# EasyEDA schematic SCH_TEMPEC-CLOUD-SMD_2022-08-11.json

## Sheets
1 CONTROL: TITLE: CONTROL; REV: 1.0; Date: 2022-07-27; Sheet: 1/1; Drawn By: GERMAN VILLARES; Company: DIINPEC
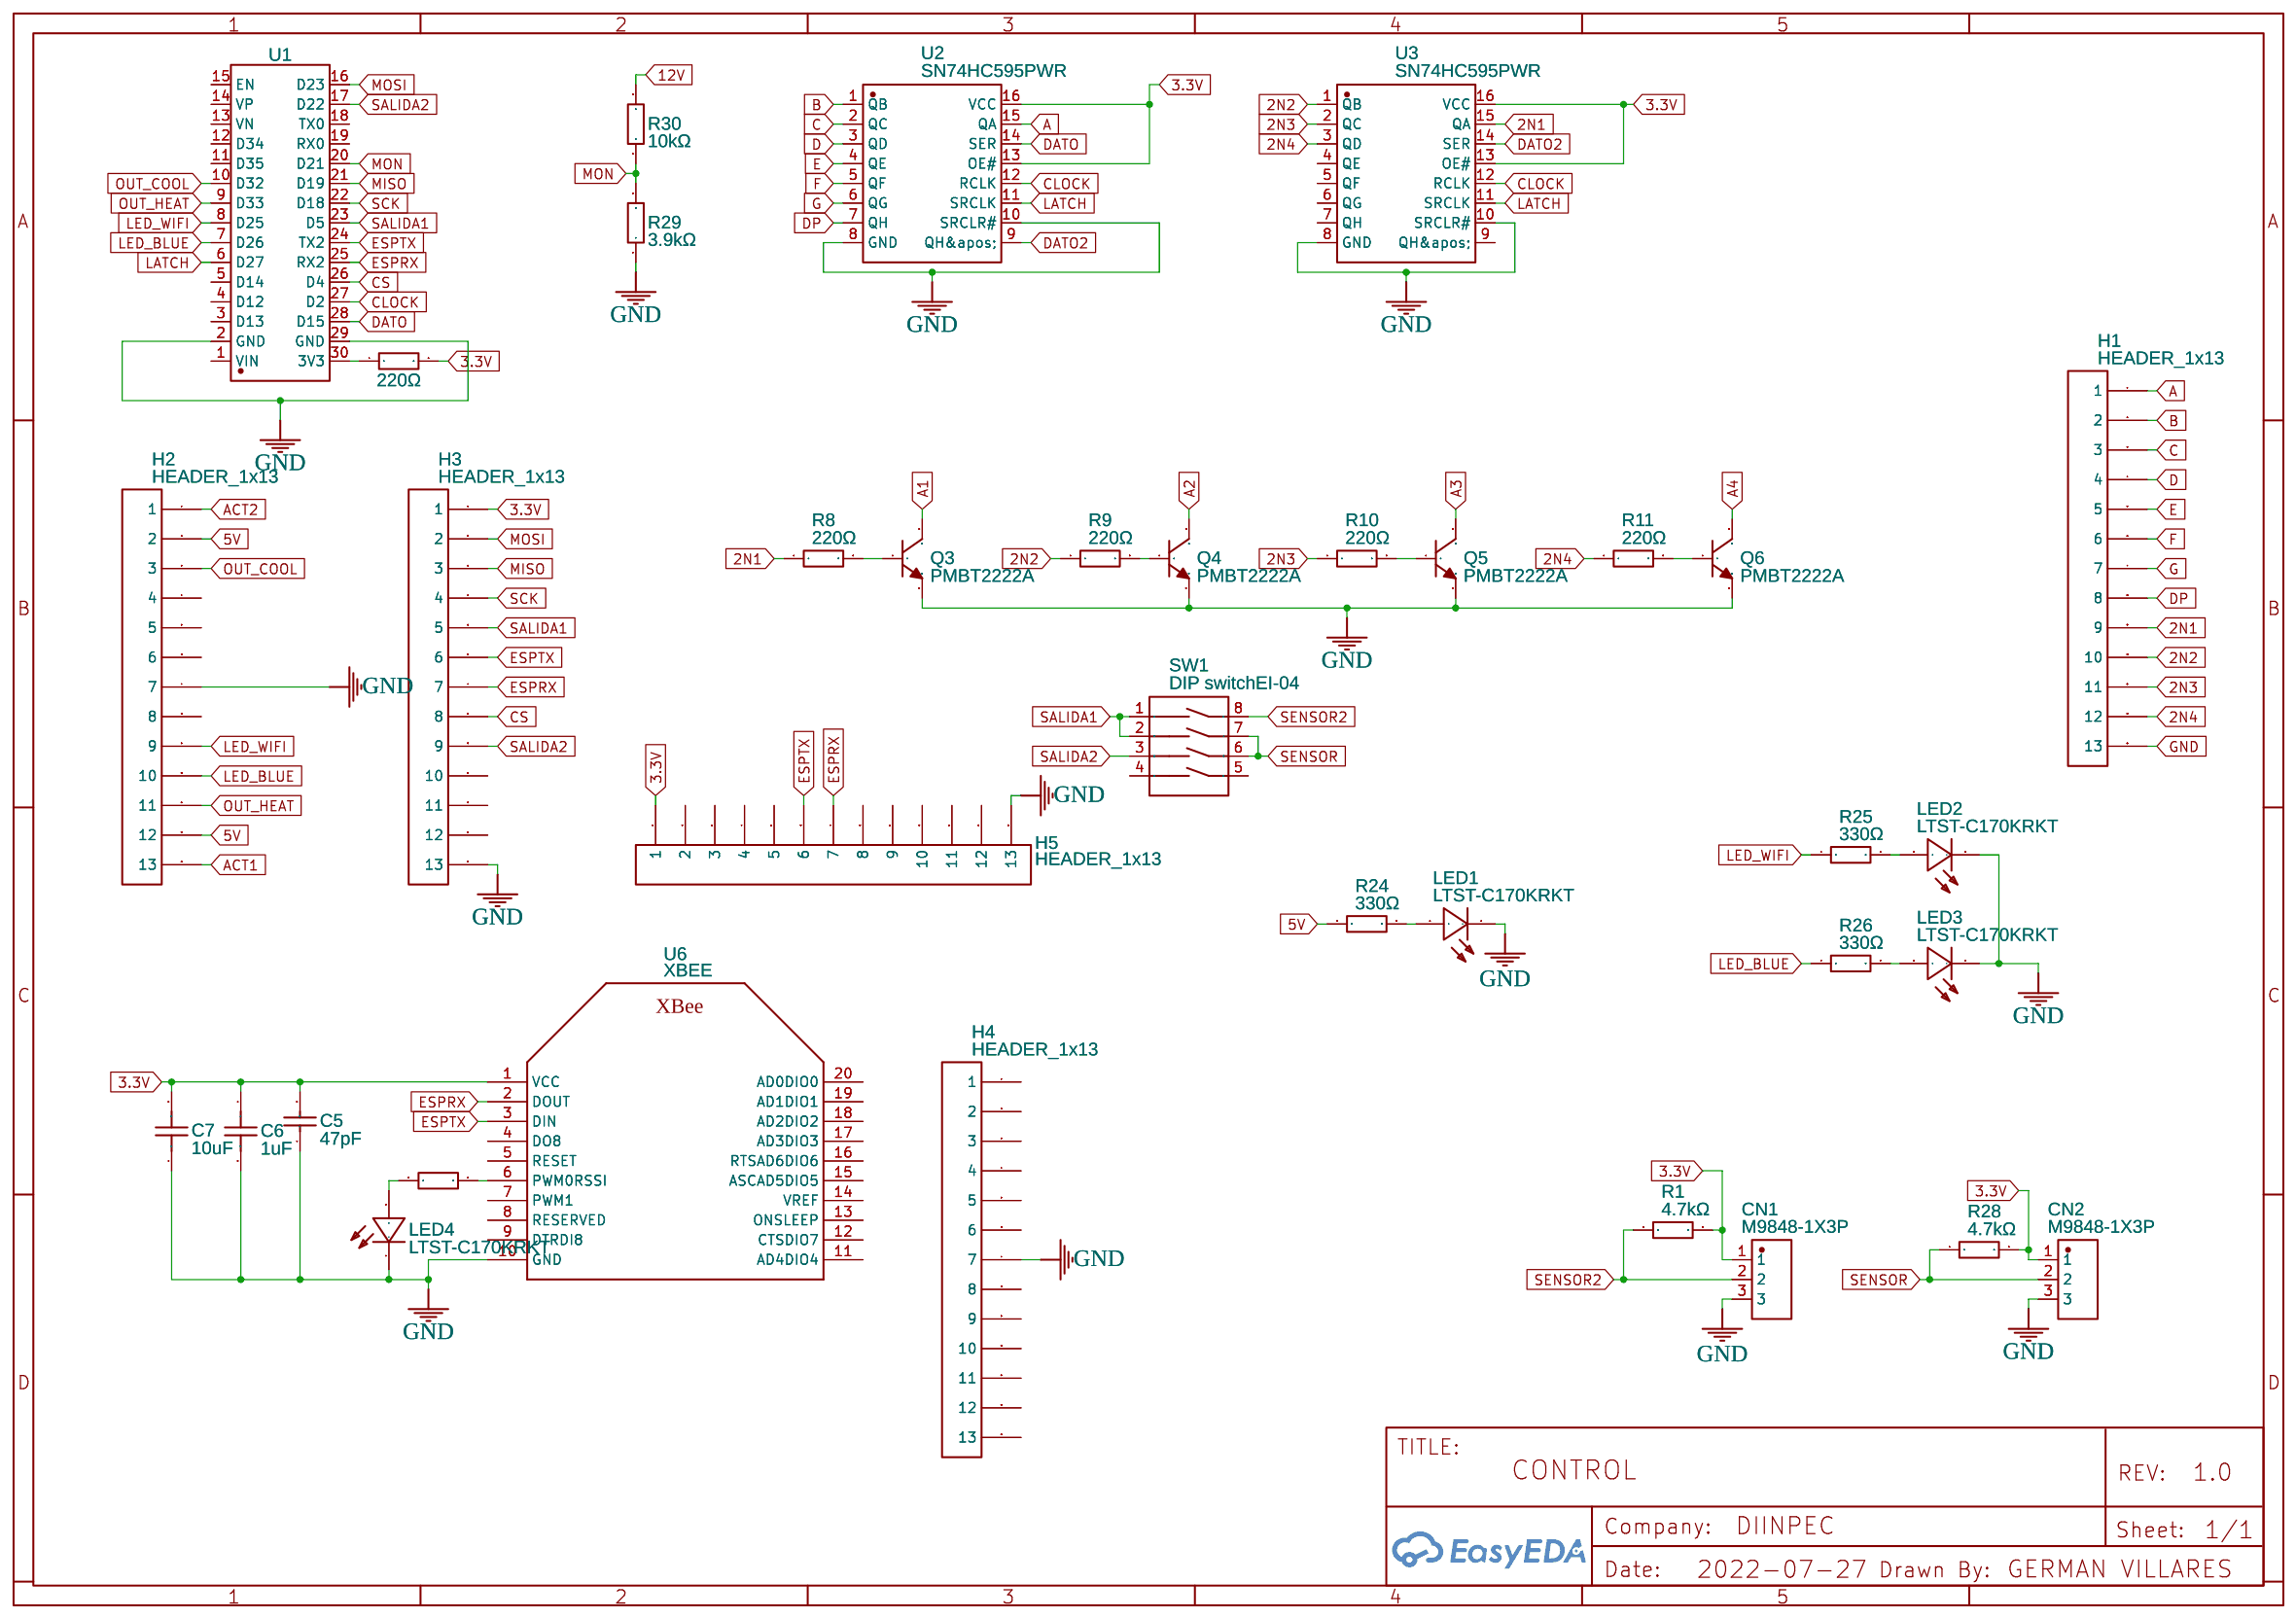
[diagram p0: CONTROL]
2 POTENCIA: TITLE: POTENCIA; Date: 2022-07-28
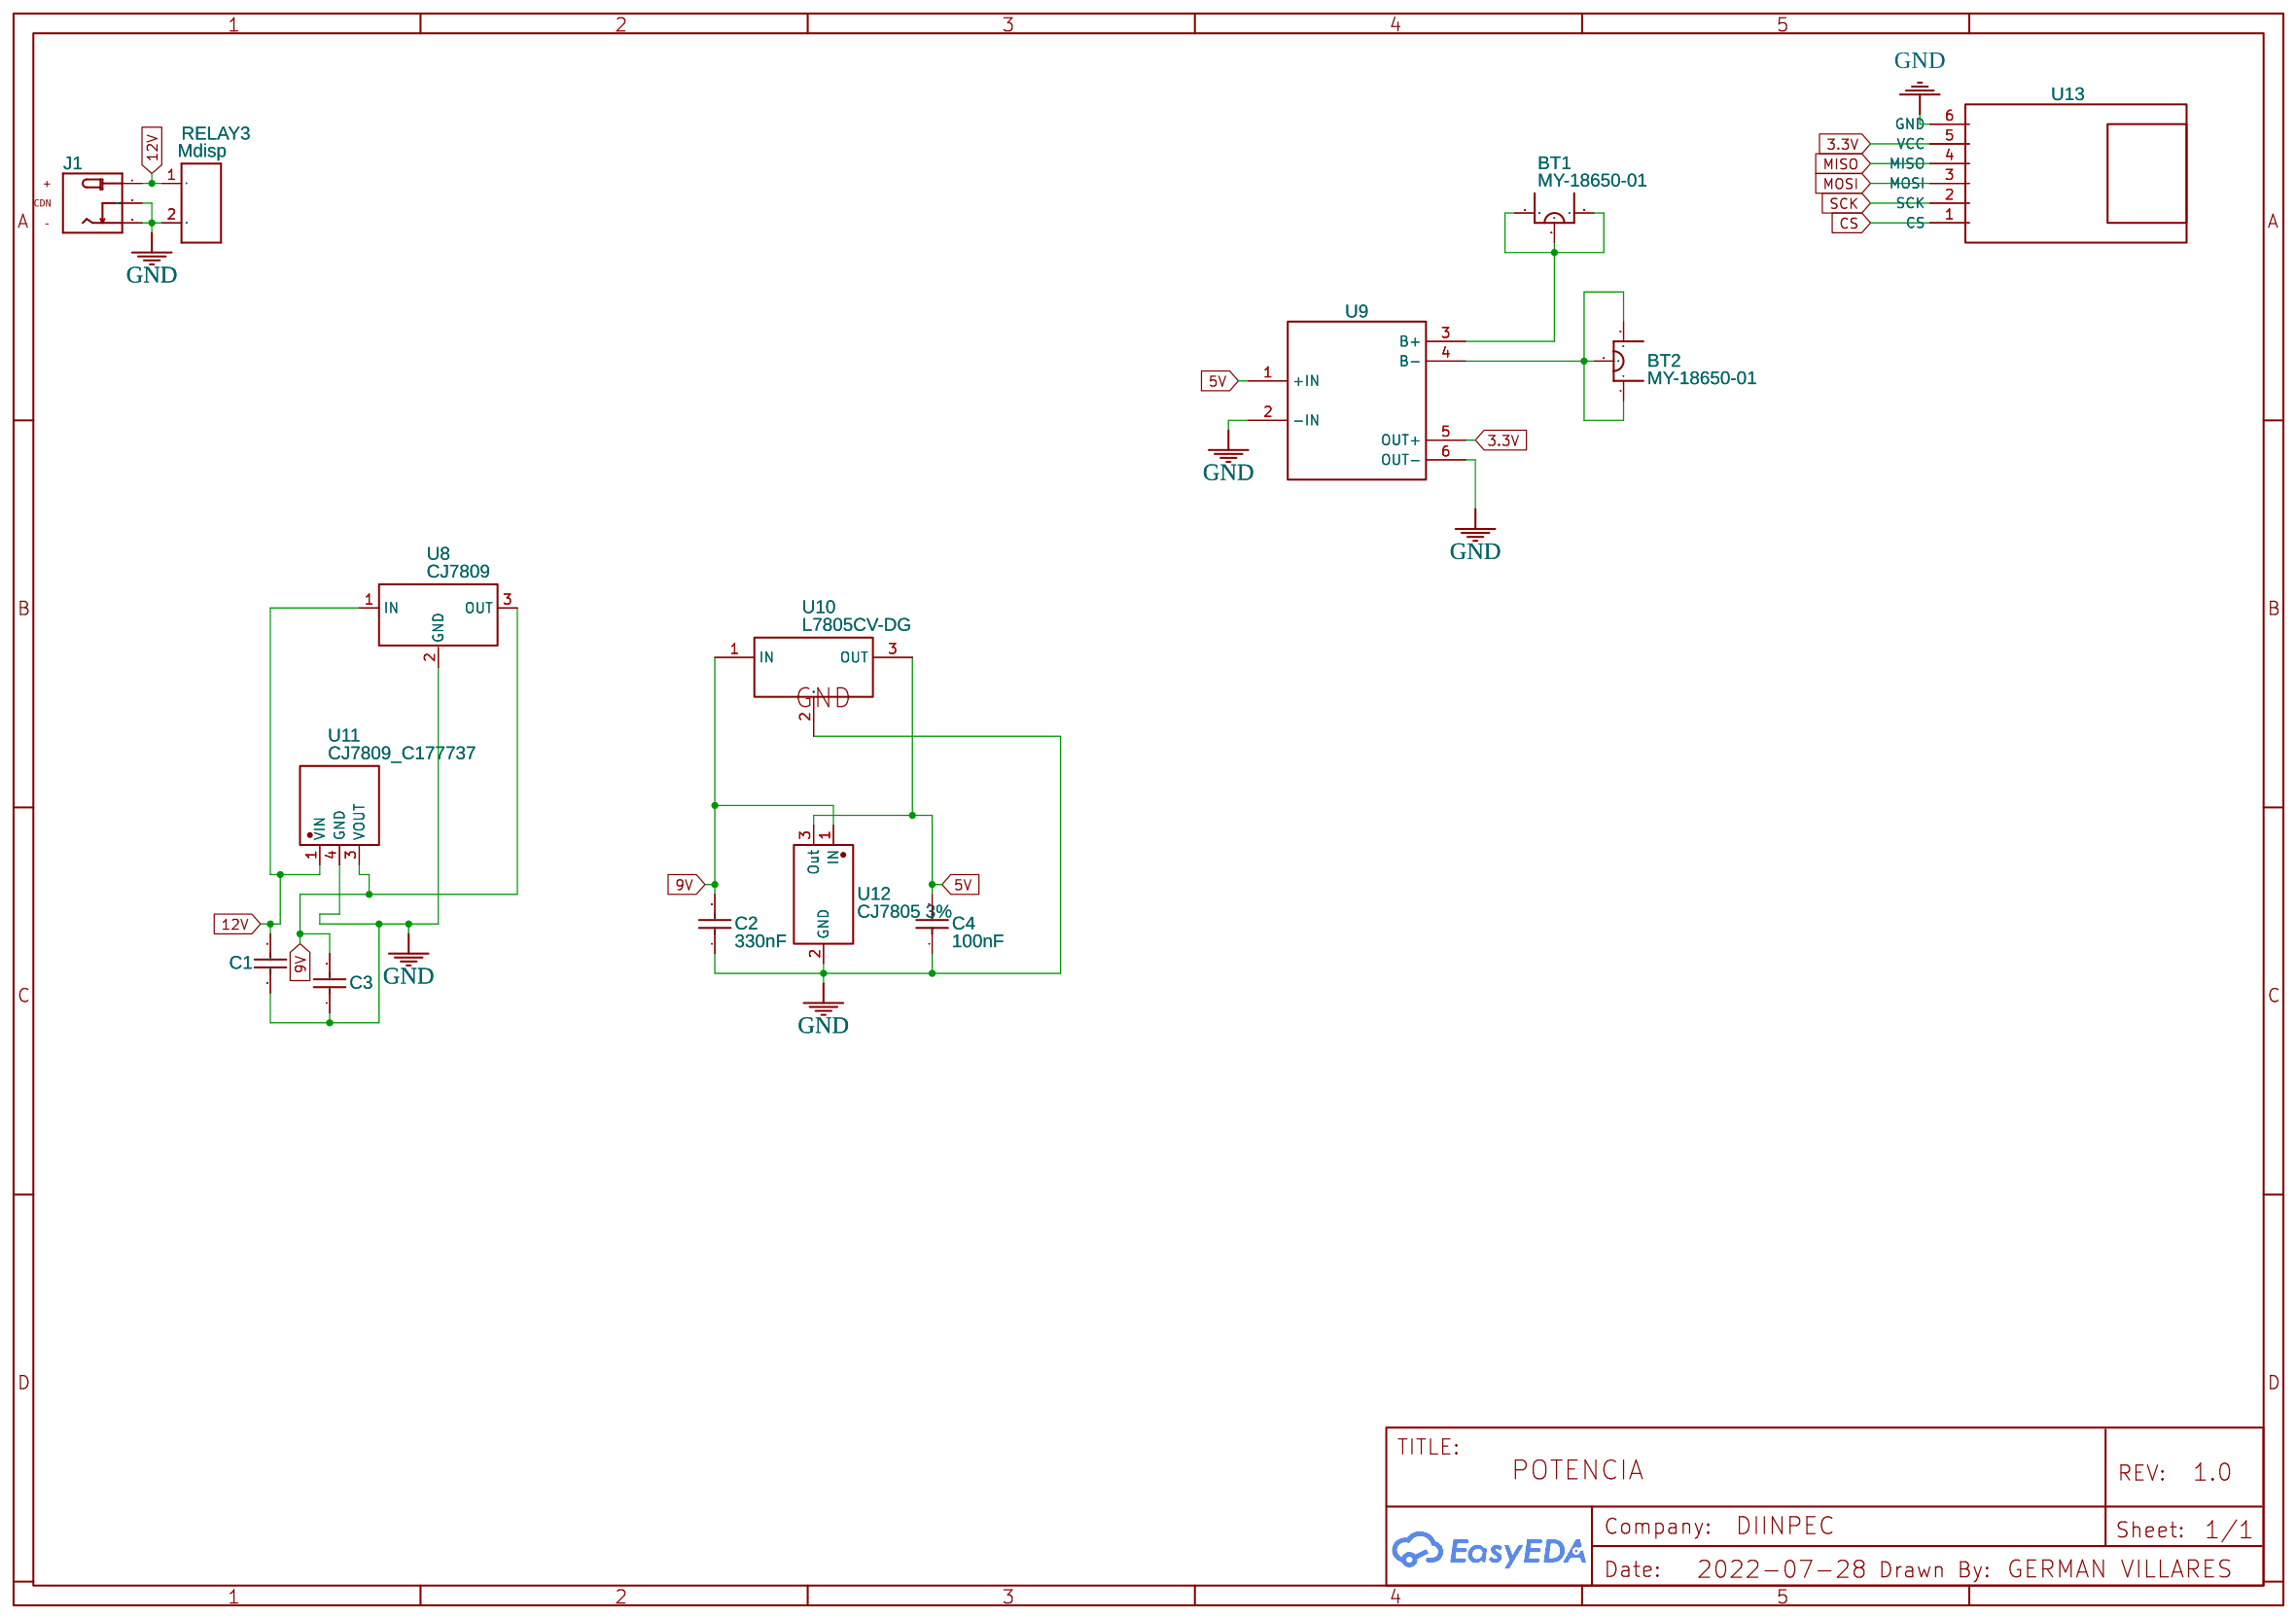
[diagram p1: POTENCIA]
3 Relevadores: TITLE: RELEVADORES; Date: 2022-08-01; Drawn By: German Villares; Company: Diinpec
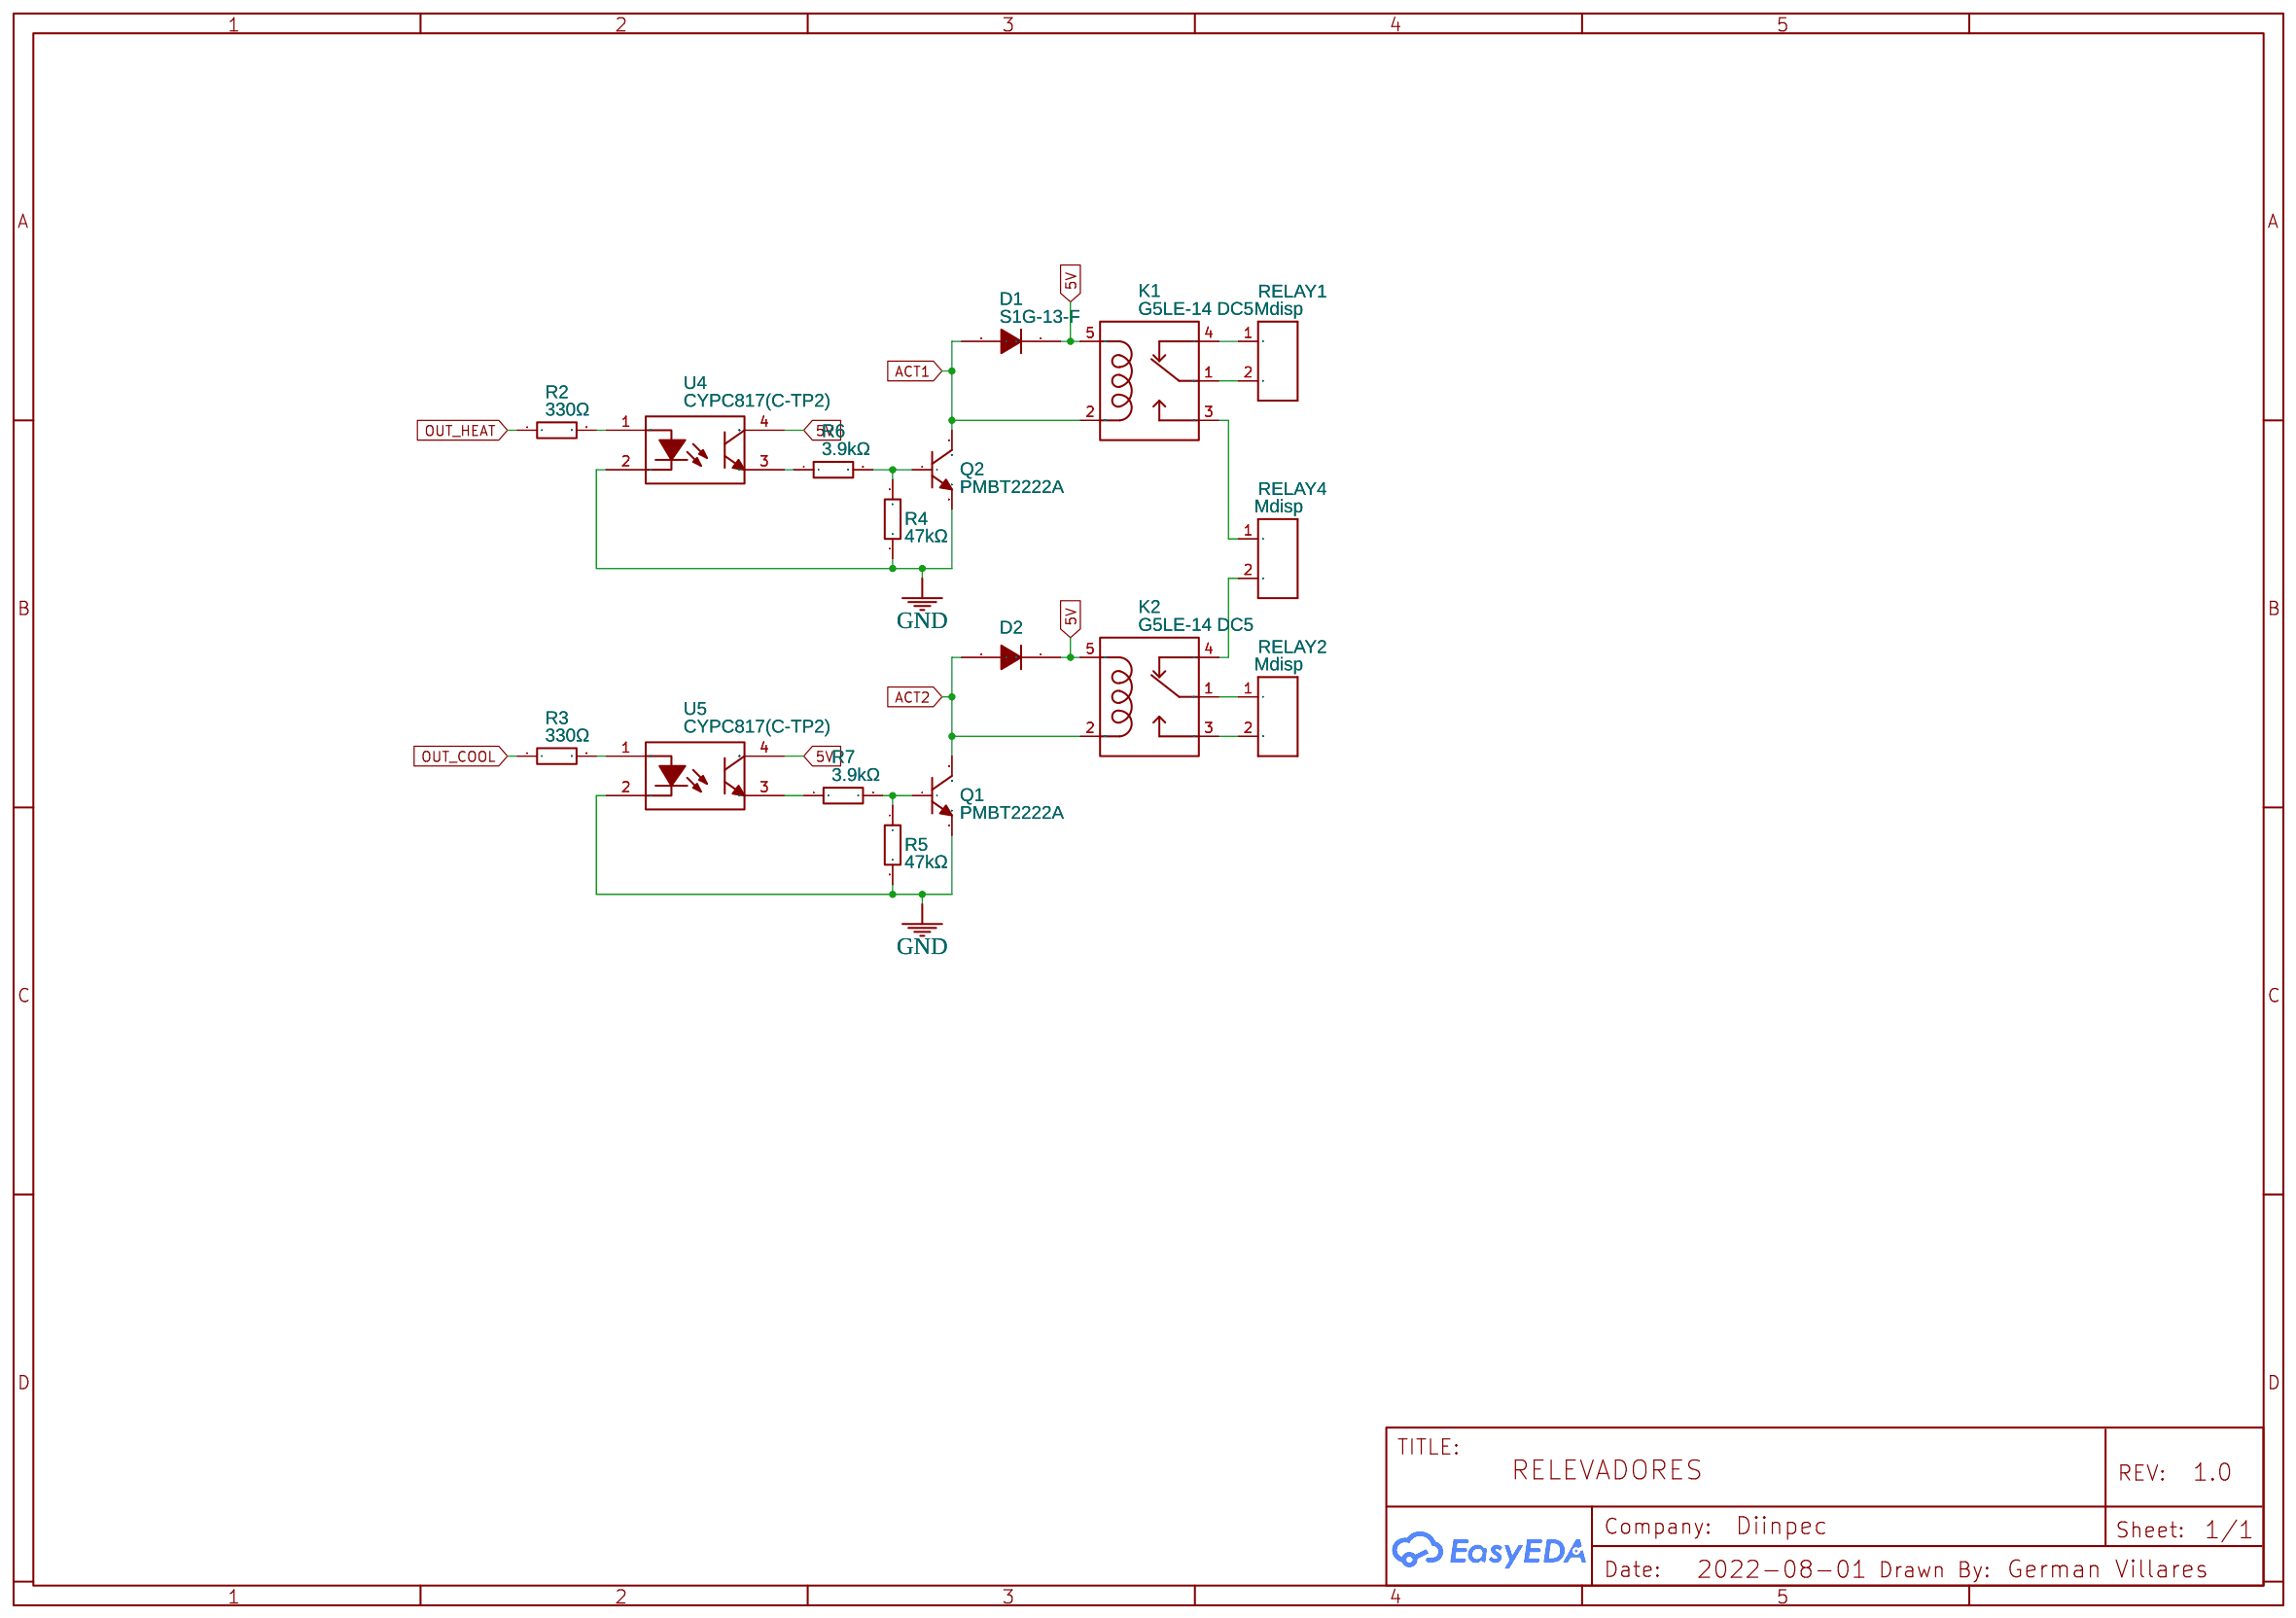
[diagram p2: Relevadores]
4 DISPLAY: TITLE: DISPLAY; Date: 2022-08-01
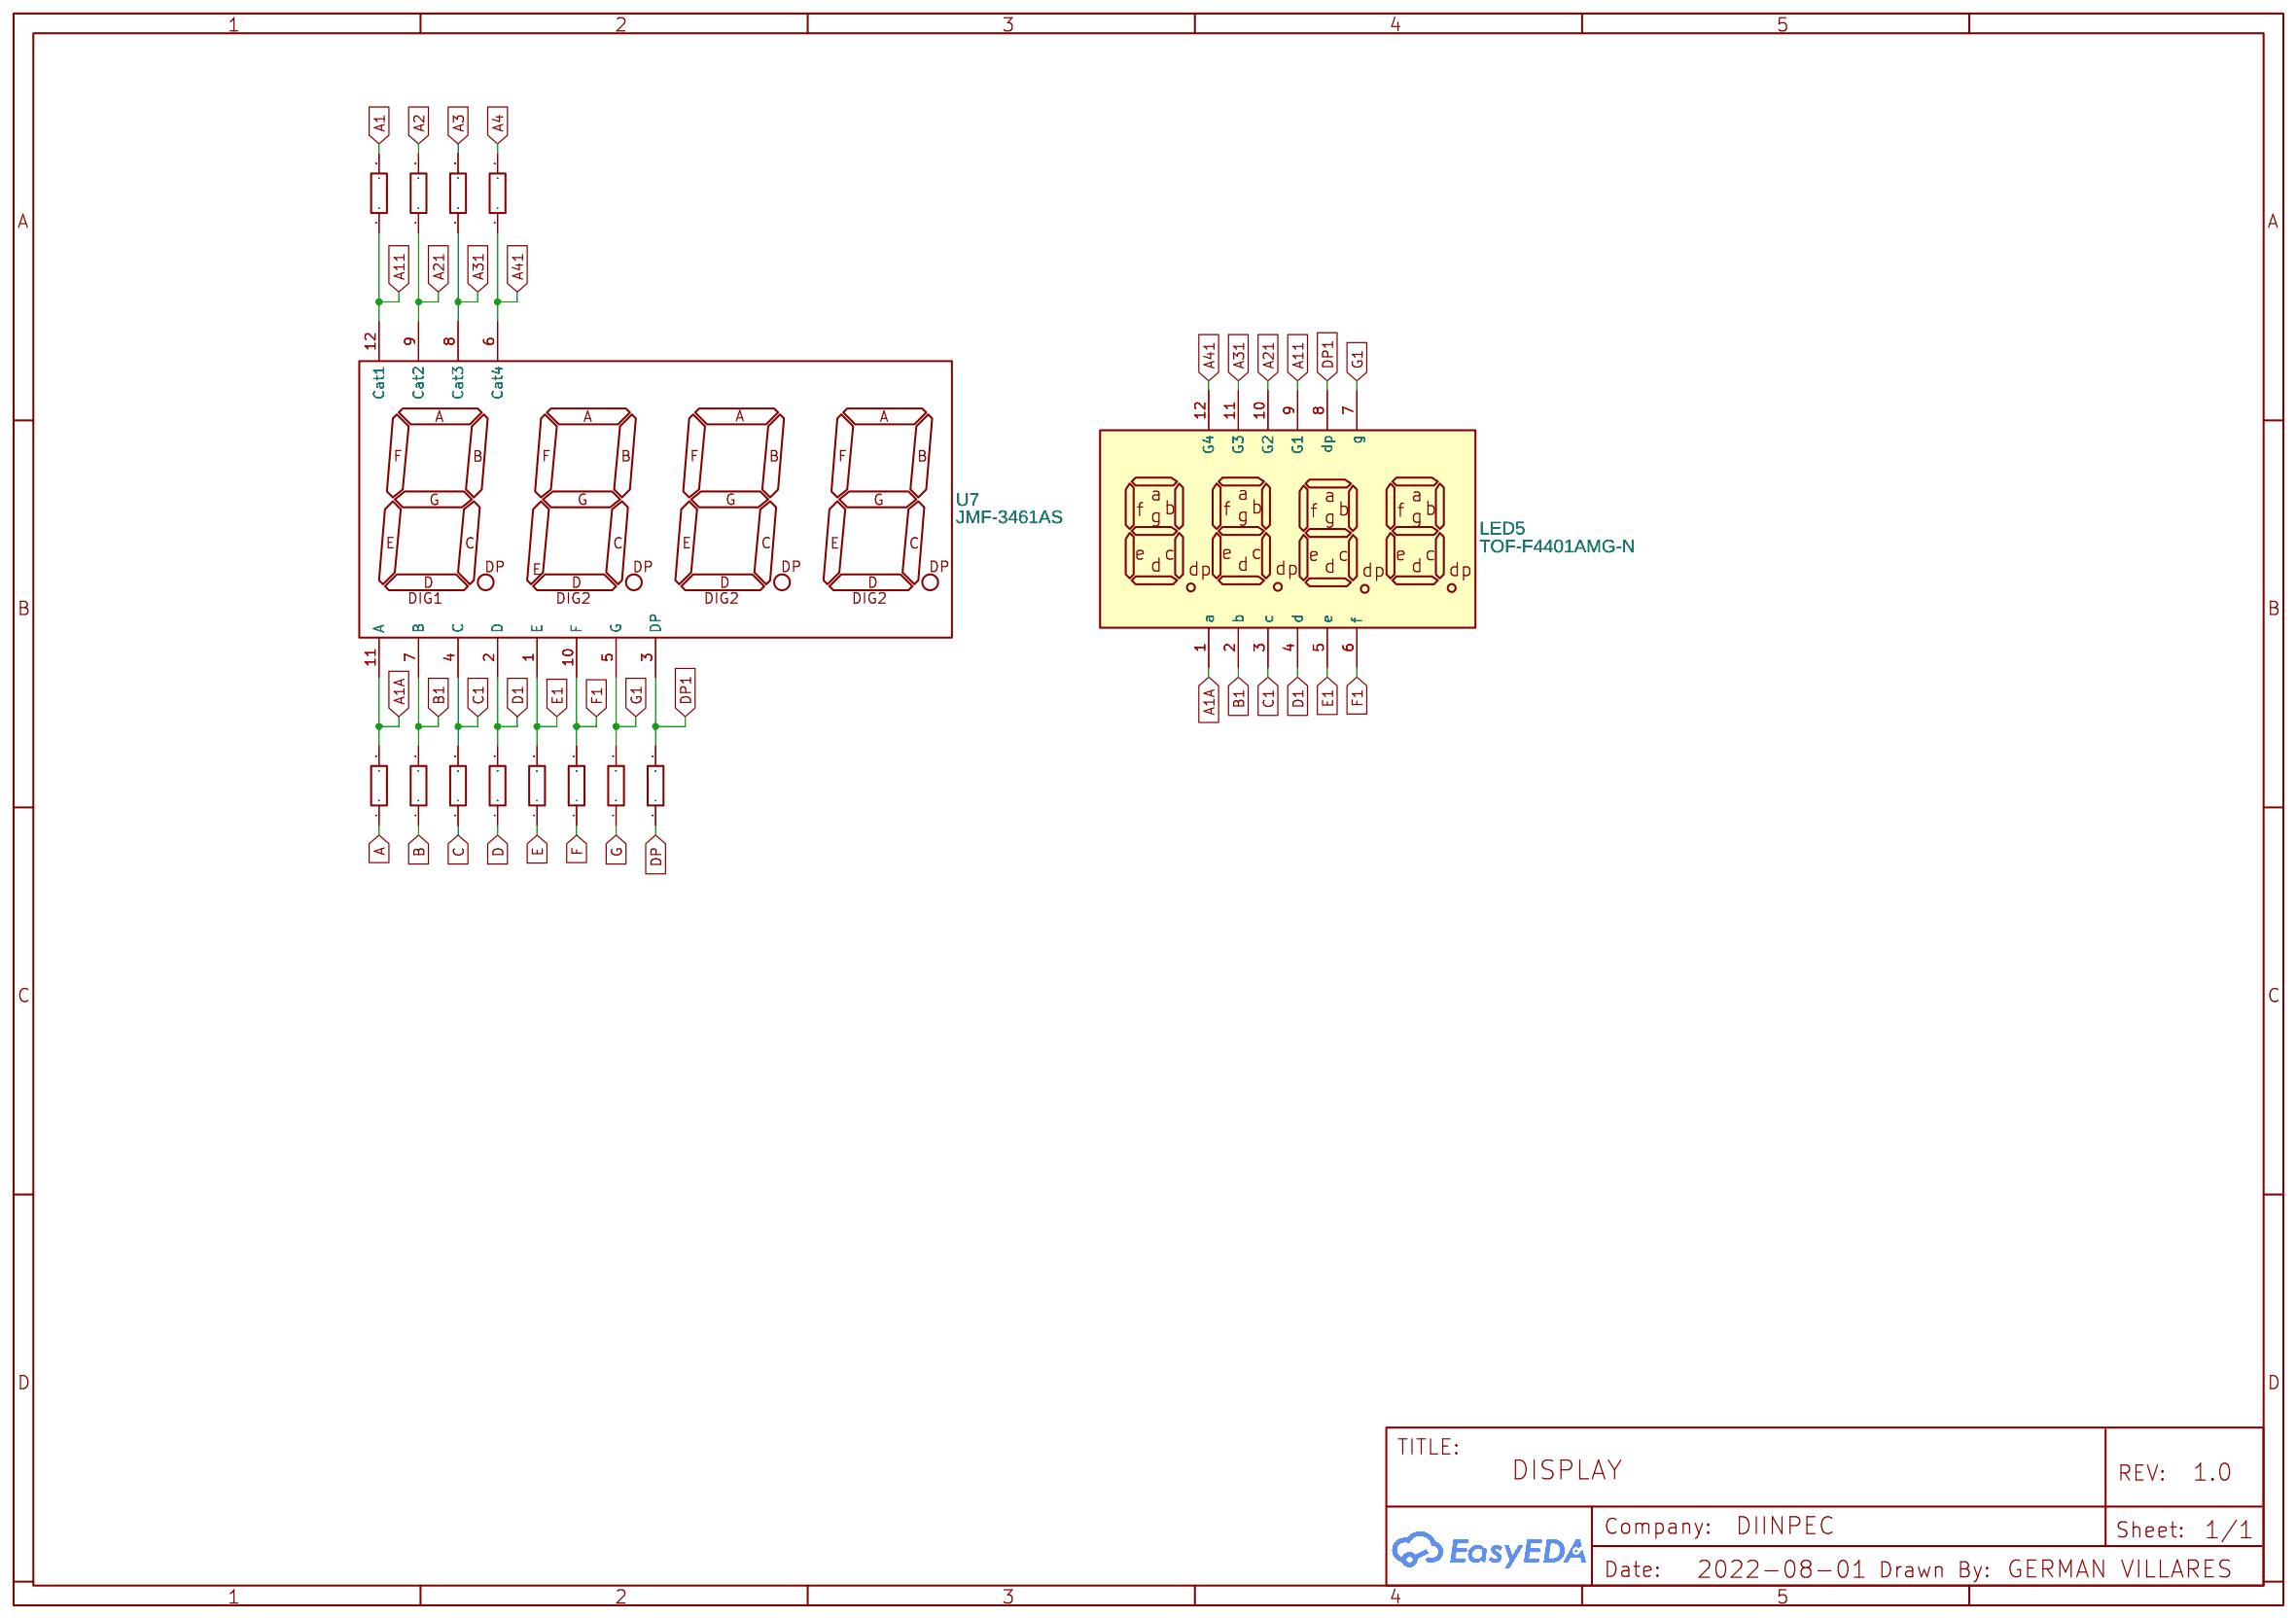
[diagram p3: DISPLAY]

## Parts
sheet CONTROL
C5  47pF  [C0805]
C6  1uF  [C0805]
C7  10uF  [C1206]
CN1  M9848-1X3P  [CONN-TH_M9848-1X3P]
CN2  M9848-1X3P  [CONN-TH_M9848-1X3P]
H1  HEADER_1x13  [HEADER_1X13]
H2  HEADER_1x13  [HEADER_1X13]
H3  HEADER_1x13  [HEADER_1X13]
H4  HEADER_1x13  [HEADER_1X13]
H5  HEADER_1x13  [HEADER_1X13]
LED1  LTST-C170KRKT  [LED0805-RD]
LED2  LTST-C170KRKT  [LED0805-RD]
LED3  LTST-C170KRKT  [LED0805-RD]
LED4  LTST-C170KRKT  [LED0805-RD]
Q3  PMBT2222A  [SOT-23-3_L2.9-W1.3-P1.90-LS2.4-BR]
Q4  PMBT2222A  [SOT-23-3_L2.9-W1.3-P1.90-LS2.4-BR]
Q5  PMBT2222A  [SOT-23-3_L2.9-W1.3-P1.90-LS2.4-BR]
Q6  PMBT2222A  [SOT-23-3_L2.9-W1.3-P1.90-LS2.4-BR]
R1  4.7kΩ  [R1206]
R8  220Ω  [R1206]
R9  220Ω  [R1206]
R10  220Ω  [R1206]
R11  220Ω  [R1206]
R24  330Ω  [R1206]
R25  330Ω  [R1206]
R26  330Ω  [R1206]
R27  220Ω  [R1206]
R28  4.7kΩ  [R1206]
R29  3.9kΩ  [R1206]
R30  10kΩ  [R1206]
R31  330Ω  [R1206]
SW1  DIP switchEI-04  [SW-TH_DIPSWITCHEI-04]
U1  ESP32-WROOM-32-DEV KIT C  [ESP32-WROOM-32 ESPRESSIF]
U2  SN74HC595PWR  [TSSOP-16_L5.0-W4.4-P0.65-LS6.4-BL]
U3  SN74HC595PWR  [TSSOP-16_L5.0-W4.4-P0.65-LS6.4-BL]
U6  XBEE  [XBEE]
sheet DISPLAY
LED5  TOF-F4401AMG-N  [LED-SEG-SMD_12P-L38.9-W15.0-P1.88-BL]
R12  220Ω  [R1206]
R13  220Ω  [R1206]
R14  220Ω  [R1206]
R15  220Ω  [R1206]
R16  220Ω  [R1206]
R17  220Ω  [R1206]
R18  220Ω  [R1206]
R19  220Ω  [R1206]
R20  220Ω  [R1206]
R21  220Ω  [R1206]
R22  220Ω  [R1206]
R23  220Ω  [R1206]
U7  JMF-3461AS  [JMF-3461AS]
sheet POTENCIA
BT1  MY-18650-01  [BAT-TH_MY-18650-01]
BT2  MY-18650-01  [BAT-TH_MY-18650-01]
C1  330nF  [C0805]
C2  330nF  [C0805]
C3  100nF  [C0805]
C4  100nF  [C0805]
J1  CONN-POWER-JACK-2.1MM_DC-005_  [DC-005]
RELAY3  Mdisp  [H2-5.0-10.5X8.0MM]
U8  CJ7809  [TO-220-3_L10.0-W4.5-P2.54-L]
U9  TP4056 MODULE D0  [TP4056]
U10  L7805CV-DG  [TO-220-3_L10.0-W4.5-P2.54-L]
U11  CJ7809_C177737  [TO-252-2_L6.5-W6.1-P4.58-LS10.0-TL]
U12  CJ7805 3%  [TO-252-2_L6.6-W6.1-P4.58-LS10.1-BR-CW]
U13  MicroSDCardAdapter  [MICROSDCARDADAPTER]
sheet Relevadores
D1  S1G-13-F  [SMA_L4.3-W2.6-LS5.2-RD]
D2  S1G-13-F  [SMA_L4.3-W2.6-LS5.2-RD]
K1  G5LE-14 DC5  [RELAY-G5LE-14]
K2  G5LE-14 DC5  [RELAY-G5LE-14]
Q1  PMBT2222A  [SOT-23-3_L2.9-W1.3-P1.90-LS2.4-BR]
Q2  PMBT2222A  [SOT-23-3_L2.9-W1.3-P1.90-LS2.4-BR]
R2  330Ω  [R1206]
R3  330Ω  [R1206]
R4  47kΩ  [R1206]
R5  47kΩ  [R1206]
R6  3.9kΩ  [R1206]
R7  3.9kΩ  [R1206]
RELAY1  Mdisp  [H2-5.0-10.5X8.0MM]
RELAY2  Mdisp  [H2-5.0-10.5X8.0MM]
RELAY4  Mdisp  [H2-5.0-10.5X8.0MM]
U4  CYPC817(C-TP2)  [SOP-4_L6.4-W4.6-P2.54-LS10.2-TL]
U5  CYPC817(C-TP2)  [SOP-4_L6.4-W4.6-P2.54-LS10.2-TL]

## Library data of the parts
C5 = CC0805JRNPO9BN470: Supplier: LCSC; Manufacturer: YAGEO; Supplier Part: C107118; JLCPCB Part Class: Extended Part
C6 = TCC0805X7R105K500DTS: Supplier: LCSC; Supplier Part: C344178; Manufacturer: CCTC; Contributor: LCSC; JLCPCB Part Class: Extended Part
C7 = CL31B106KBHNNNE: Supplier: LCSC; Manufacturer: SAMSUNG; Supplier Part: C89632; JLCPCB Part Class: Extended Part
CN1 CN2 = M9848-1X3P: Supplier: LCSC; Supplier Part: C492604; Manufacturer: XFCN; Manufacturer Part: M9848-1x3P; Contributor: LCSC; JLCPCB Part Class: Extended Part
H1-H5 = HEADER_1x13: Contributor: kikizg
LED1-LED4 = LTST-C170KRKT: Supplier: LCSC; Manufacturer: LITEON; Supplier Part: C94868; JLCPCB Part Class: Extended Part
Q1-Q6 = PMBT2222A: Supplier: LCSC; Manufacturer: Nexperia; Supplier Part: C23869; JLCPCB Part Class: Extended Part
R1 R28 = RS-06K472JT: Supplier: LCSC; Manufacturer: FH; Supplier Part: C118074; Resistance (Ohms): 4.7K; JLCPCB Part Class: Extended Part
R8-R11 R27 = CR1206F42200G: Supplier: LCSC; Manufacturer: LIZ; Supplier Part: C102128; Resistance (Ohms): 220; JLCPCB Part Class: Extended Part
R2 R3 R24-R26 R31 = 1206W4F3300T5E: Supplier: LCSC; Manufacturer: UniOhm; Supplier Part: C17930; Resistance (Ohms): 330; JLCPCB Part Class: Extended Part
R6 R7 R29 = RMC12063.9K5%N: Supplier: LCSC; Supplier Part: C269606; Manufacturer: Tyohm; Resistance (Ohms): 3.9K; Contributor: LCSC; JLCPCB Part Class: Extended Part
R30 = RTT061002FTP: Supplier: LCSC; Manufacturer: RALEC; Supplier Part: C104595; Resistance (Ohms): 10K; JLCPCB Part Class: Extended Part
SW1 = DIP switchEI-04: Supplier: LCSC; Manufacturer: DIP; Supplier Part: C99987; JLCPCB Part Class: Extended Part
U1 = ESP32-WROOM-32-DEV KIT C: Contributor: KevinRamesh
U2 U3 = SN74HC595PWR: Supplier: LCSC; Supplier Part: C273642; Manufacturer: Texas Instruments; Contributor: LCSC; JLCPCB Part Class: Extended Part
U6 = -: Contributor: Adafruit
LED5 = TOF-F4401AMG-N: Supplier: LCSC; Supplier Part: C325426; Manufacturer: OASIS; Contributor: LCSC
R12-R23 = AECR1206F220RK9: Supplier: LCSC; Supplier Part: C352117; Manufacturer: ResistorToday; Resistance (Ohms): 220; Contributor: LCSC; JLCPCB Part Class: Extended Part
U7 = JMF-3461AS: Manufacturer Part: 3461AS; Contributor: Agrus
BT1 BT2 = MY-18650-01: Supplier: LCSC; Supplier Part: C2979183; Manufacturer: MYOUNG(美阳); link: https://atta.szlcsc.com/upload/public/pdf/source/20220302/9B78703FC9BDD52215F97855EB9B4A89.pdf; Contributor: LCSC; JLCPCB Part Class: Extended Part
C1 C2 = 0805F334M500NT: Supplier: LCSC; Manufacturer: FH; Supplier Part: C1775; JLCPCB Part Class: Extended Part
C3 C4 = CL21B104JBCNNNC: Supplier: LCSC; Manufacturer: SAMSUNG; Supplier Part: C62912; JLCPCB Part Class: Extended Part
J1 = CONN-POWER-JACK-2.1MM_DC-005_: Contributor: Psquirm
RELAY1-RELAY4 = -: Screw Terminal; Manufacturer Part: ?
U8 = CJ7809: Supplier: LCSC; Manufacturer: CJ; Supplier Part: C105445; JLCPCB Part Class: Extended Part
U9 = TP4056 MODULE D0: Contributor: Денис Домрачев (Seturian)
U10 = L7805CV-DG: Supplier: LCSC; Manufacturer: STMicroelectronics; Supplier Part: C3795; JLCPCB Part Class: Extended Part
U11 = CJ7809_C177737: Supplier: LCSC; Supplier Part: C177737; Manufacturer: Changjiang Electronics Tech (CJ); Manufacturer Part: CJ7809; Contributor: LCSC; JLCPCB Part Class: Extended Part
U12 = CJ7805 3%: Supplier: LCSC; Manufacturer: CJ; Supplier Part: C21706; JLCPCB Part Class: Extended Part
U13 = MicroSDCardAdapter: Contributor: appurva
D1 D2 = S1G-13-F: Supplier: LCSC; Manufacturer: DIODES; Supplier Part: C85102; JLCPCB Part Class: Extended Part
K1 K2 = -: Supplier: LCSC; Supplier Part: C152709; Manufacturer: Omron Electronics; Contributor: LCSC
R4 R5 = RTT06473JTP: Supplier: LCSC; Manufacturer: RALEC; Supplier Part: C104822; Resistance (Ohms): 47K; JLCPCB Part Class: Extended Part
U4 U5 = CYPC817(C-TP2): Supplier: LCSC; Supplier Part: C385058; Manufacturer: OCIC; Contributor: LCSC; JLCPCB Part Class: Extended Part

## Nets
3.3V: C5.2 C6.1 C7.2 CN1.1 CN2.1 H3.1 H5.1 R1.2 R27.2 R28.2 U2.13(OE#) U2.16(VCC) U3.13(OE#) U3.16(VCC) U6.1(VCC) U9.5(OUT+) U13.5(VCC)
5V: C4.2 D1.1(C) D2.1(C) H2.2 H2.12 K1.5(COIL1) K2.5(COIL1) R24.1 U4.4(COL) U5.4(COL) U9.1(+IN) U10.3(OUT) U12.3(Out)
9V: C2.2 C3.2 U8.3(OUT) U10.1(IN) U11.3(VOUT) U12.1(IN)
12V: C1.2 J1.1(+) R30.2 RELAY3.1 U8.1(IN) U11.1(VIN)
GND: C1.1 C2.1 C3.1 C4.1 C5.1 C6.2 C7.1 CN1.3 CN2.3 H1.13 H2.7 H3.13 H4.7 H5.13 J1.2(CDN) J1.3(-) LED1.1(-) LED2.1(-) LED3.1(-) LED4.1(-) Q1.2 Q2.2 Q3.2 Q4.2 Q5.2 Q6.2 R4.1 R5.2 R29.1 RELAY3.2 U1.2(GND) U1.29(GND) U2.8(GND) U2.10(SRCLR#) U3.8(GND) U3.10(SRCLR#) U4.2(CAT) U5.2(CAT) U6.10(GND) U8.2(GND) U9.2(-IN) U9.6(OUT-) U10.2(GND) U11.4(GND) U12.2(GND) U13.6(GND)
2N1: H1.9 R8.1 U3.15(QA)
2N2: H1.10 R9.1 U3.1(QB)
2N3: H1.11 R10.1 U3.2(QC)
2N4: H1.12 R11.1 U3.3(QD)
A: H1.1 R12.1 U2.15(QA)
A1: Q3.3 R20.2
A1A: LED5.1(a) R12.2 U7.11(A)
A2: Q4.3 R21.2
A3: Q5.3 R22.2
A4: Q6.3 R23.2
A11: LED5.9(G1) R20.1 U7.12(Cat1)
A21: LED5.10(G2) R21.1 U7.9(Cat2)
A31: LED5.11(G3) R22.1 U7.8(Cat3)
A41: LED5.12(G4) R23.1 U7.6(Cat4)
ACT1: D1.2(A) H2.13 K1.2(COIL2) Q2.3
ACT2: D2.2(A) H2.1 K2.2(COIL2) Q1.3
B: H1.2 R13.1 U2.1(QB)
B1: LED5.2(b) R13.2 U7.7(B)
C: H1.3 R14.1 U2.2(QC)
C1: LED5.3(c) R14.2 U7.4(C)
CLOCK: U1.27(D2) U2.12(RCLK) U3.12(RCLK)
CS: H3.8 U1.26(D4) U13.1(CS)
D: H1.4 R15.1 U2.3(QD)
D1: LED5.4(d) R15.2 U7.2(D)
DATO: U1.28(D15) U2.14(SER)
DATO2: U2.9(QH') U3.14(SER)
DP: H1.8 R19.1 U2.7(QH)
DP1: LED5.8(dp) R19.2 U7.3(DP)
E: H1.5 R16.1 U2.4(QE)
E1: LED5.5(e) R16.2 U7.1(E)
ESPRX: H3.7 H5.7 U1.25(RX2) U6.2(DOUT)
ESPTX: H3.6 H5.6 U1.24(TX2) U6.3(DIN)
F: H1.6 R17.1 U2.5(QF)
F1: LED5.6(f) R17.2 U7.10(F)
G: H1.7 R18.1 U2.6(QG)
G1: LED5.7(g) R18.2 U7.5(G)
LATCH: U1.6(D27) U2.11(SRCLK) U3.11(SRCLK)
LED_BLUE: H2.10 R26.1 U1.7(D26)
LED_WIFI: H2.9 R25.1 U1.8(D25)
MISO: H3.3 U1.21(D19) U13.4(MISO)
MON: R29.2 R30.1 U1.20(D21)
MOSI: H3.2 U1.16(D23) U13.3(MOSI)
OUT_COOL: H2.3 R3.1 U1.10(D32)
OUT_HEAT: H2.11 R2.1 U1.9(D33)
SALIDA1: H3.5 SW1.1 SW1.2 U1.23(D5)
SALIDA2: H3.9 SW1.3 U1.17(D22)
SCK: H3.4 U1.22(D18) U13.2(SCK)
SENSOR: CN2.2 R28.1 SW1.6 SW1.7
SENSOR2: CN1.2 R1.1 SW1.8
Net-(BT1-1): BT1.1 BT1.2 BT1.3 U9.3(B+)
Net-(BT2-1): BT2.1 BT2.2 BT2.3 U9.4(B-)
Net-(K1-1): K1.1(MAIN) RELAY1.2
Net-(K1-3): K1.3(NO) RELAY4.1
Net-(K1-4): K1.4(NC) RELAY1.1
Net-(K2-1): K2.1(MAIN) RELAY2.1
Net-(K2-3): K2.3(NO) RELAY2.2
Net-(K2-4): K2.4(NC) RELAY4.2
Net-(LED1-2): LED1.2(+) R24.2
Net-(LED2-2): LED2.2(+) R25.2
Net-(LED3-2): LED3.2(+) R26.2
Net-(LED4-2): LED4.2(+) R31.2
Net-(Q1-1): Q1.1 R5.1 R7.2
Net-(Q2-1): Q2.1 R4.2 R6.2
Net-(Q3-1): Q3.1 R8.2
Net-(Q4-1): Q4.1 R9.2
Net-(Q5-1): Q5.1 R10.2
Net-(Q6-1): Q6.1 R11.2
Net-(R2-2): R2.2 U4.1(AN)
Net-(R3-2): R3.2 U5.1(AN)
Net-(R6-1): R6.1 U4.3(EMI)
Net-(R7-1): R7.1 U5.3(EMI)
Net-(R27-1): R27.1 U1.30(3V3)
Net-(R31-1): R31.1 U6.6(PWM0RSSI)

Not connected (* = marked no-connect by the designer): H2 4 5 6 8; H3 10 11 12; H4 1 2 3 4 5 6 8 9 10 11 12 13; H5 2 3 4 5 8 9 10 11 12; SW1 4 5; U1 1(VIN) 3(D13) 4(D12) 5(D14) 11(D35) 12(D34) 13(VN) 14(VP) 15(EN) 18(TX0) 19(RX0); U3 4(QE) 5(QF) 6(QG) 7(QH) 9(QH'); U6 4(DO8) 5(RESET) 7(PWM1) 8(RESERVED) 9(DTRDI8) 11(AD4DIO4) 12(CTSDIO7) 13(ONSLEEP) 14(VREF) 15(ASCAD5DIO5) 16(RTSAD6DIO6) 17(AD3DIO3) 18(AD2DIO2) 19(AD1DIO1) 20(AD0DIO0)
